# EAGLE design ultrasonic_distance_meter (EAGLE 6.1)
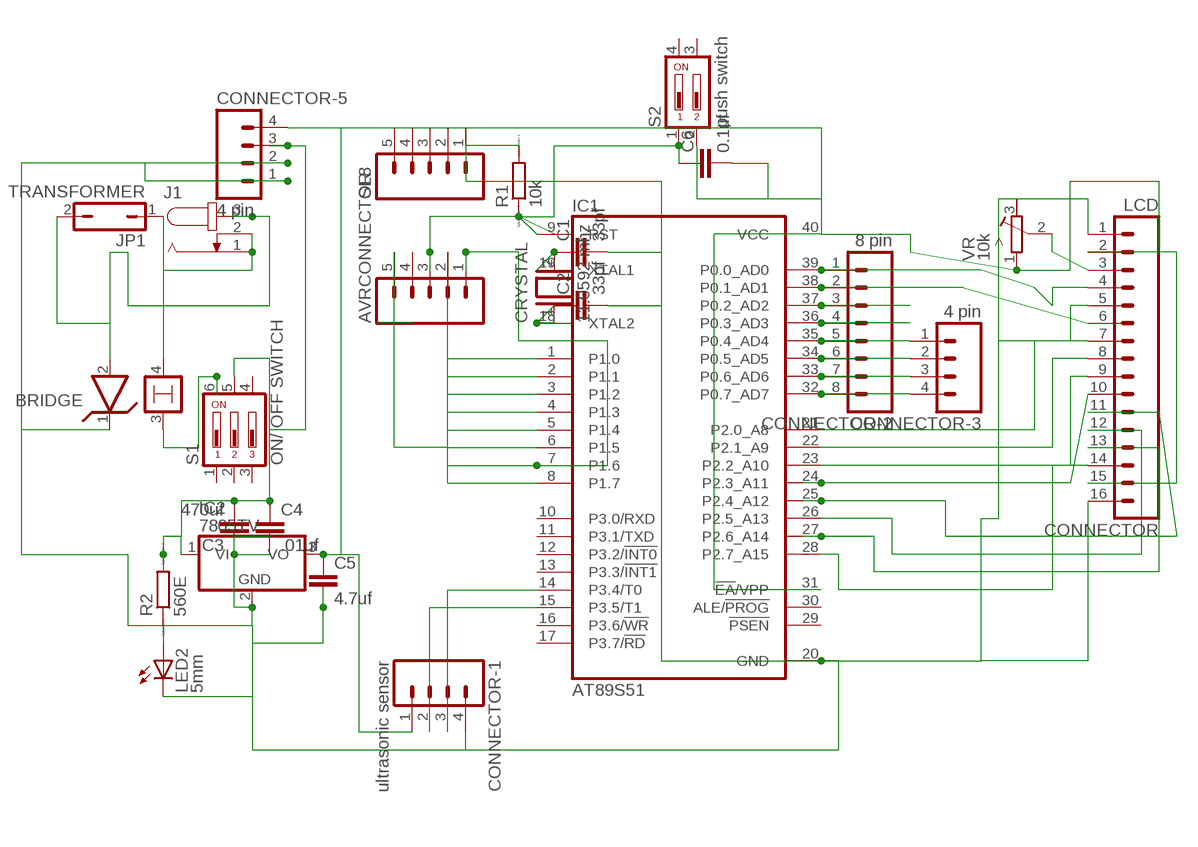
[diagram p0: schematic, sheet 1]

## Parts
AVRCONNECTOR  M05  [05P]
BRIDGE  LM399H  [TO39/4]
C1  33pf  C-EU025-024X044  [C025-024X044]
C2  33pf  C-EU025-024X044  [C025-024X044]
C3  470uf  C5/7.2  [C5B7.2]
C4  .01uf  C2,5-3  [C2.5-3]
C5  4.7uf  C2,5-3  [C2.5-3]
C6  0.1uf  C2.5/6  [C2.5-6]
CONNECTOR  LCD  M16  [16P]
CONNECTOR-1  ultrasonic sensor  M04  [04P]
CONNECTOR-2  8 pin  M08  [08P]
CONNECTOR-3  4 pin  M04  [04P]
CONNECTOR-5  4 pin  M04  [04P]
CRYSTAL  11.0592 mhz  XTAL/S  [QS]
IC1  AT89S51  AT89C51-12PC  [DIL40]
IC2  7805TV  [TO220V]
J1  JACK-PLUG0  [SPC4077]
JP1  TRANSFORMER  JP1Q  [JP1]
LED2  5mm  LED5MM  [LED5MM]
R1  10k  R0204/7  [0204/7]
R2  560E  R0204/7  [0204/7]
S1  ON/ OFF SWITCH  DA03  [DA-03]
S2  push switch  DP02  [DP-02]
SL8  M05  [05P]
VR  10k  R-TRIMM64P  [RTRIM64P]

## Nets
N$1: C2.1 CRYSTAL.1 IC1.18(XTAL2)
N$2: C1.1 CRYSTAL.2 IC1.19(XTAL1)
N$3: CONNECTOR-1.2 IC1.15(P3.5/T1)
N$4: C3.2 C4.1 CONNECTOR-5.3 IC2.1(VI) R2.2 S1.5
N$5: BRIDGE.2 J1.3 JP1.2
N$6: CONNECTOR-1.3 IC1.14(P3.4/T0)
N$14: AVRCONNECTOR.3 C6.1 IC1.9(RST) R1.1 S2.1
N$15: AVRCONNECTOR.1 IC1.7(P1.6)
N$16: BRIDGE.4 J1.1 J1.2 JP1.1
N$17: IC1.5(P1.4)
N$18: IC1.4(P1.3)
N$19: IC1.3(P1.2)
N$20: IC1.2(P1.1)
N$21: IC1.1(P1.0)
N$24: CONNECTOR-2.3 IC1.37(P0.2_AD2)
N$25: CONNECTOR-2.4 IC1.36(P0.3_AD3)
N$26: CONNECTOR-2.5 CONNECTOR-3.1 IC1.35(P0.4_AD4)
N$27: CONNECTOR-2.6 CONNECTOR-3.2 IC1.34(P0.5_AD5)
N$28: CONNECTOR-2.7 CONNECTOR-3.3 IC1.33(P0.6_AD6)
N$29: CONNECTOR-2.8 CONNECTOR-3.4 IC1.32(P0.7_AD7)
N$30: CONNECTOR.7 IC1.21(P2.0_A8)
N$31: CONNECTOR.8 IC1.22(P2.1_A9)
N$32: CONNECTOR.9 IC1.23(P2.2_A10)
N$35: CONNECTOR.12 IC1.26(P2.5_A13)
N$38: CONNECTOR.3 VR.2(S)
N$39: C5.1 C6.2 CONNECTOR-1.1 CONNECTOR-5.4 CONNECTOR.2 CONNECTOR.15 IC1.31(!EA!/VPP) IC1.40(VCC) IC2.3(VO) S2.2 VR.1(E)
N$41: BRIDGE.1 C1.2 C2.2 C3.1 C4.2 C5.2 CONNECTOR-1.4 CONNECTOR-5.1 CONNECTOR-5.2 CONNECTOR.1 CONNECTOR.5 CONNECTOR.16 IC1.20(GND) IC2.2(GND) LED2.K(C) R1.2 SL8.1 VR.3(A)
N$42: AVRCONNECTOR.5 IC1.6(P1.5)
N$43: LED2.A R2.1
N$45: AVRCONNECTOR.2 IC1.8(P1.7)
N$47: BRIDGE.3 S1.6
N$48: CONNECTOR-2.2 CONNECTOR.6 IC1.38(P0.1_AD1)
N$51: CONNECTOR.10 IC1.24(P2.3_A11)
N$52: CONNECTOR.11 IC1.25(P2.4_A12)
N$54: CONNECTOR.13 IC1.27(P2.6_A14)
N$55: CONNECTOR.14 IC1.28(P2.7_A15)
N$58: CONNECTOR-2.1 CONNECTOR.4 IC1.39(P0.0_AD0)
Unconnected: AVRCONNECTOR.4 IC1.10(P3.0/RXD) IC1.11(P3.1/TXD) IC1.12(P3.2/!INT0) IC1.13(P3.3/!INT1) IC1.16(P3.6/!WR) IC1.17(P3.7/!RD) IC1.29(!PSEN) IC1.30(ALE/!PROG) S1.1 S1.2 S1.3 S1.4 S2.3 S2.4 SL8.2 SL8.3 SL8.4 SL8.5

## Library data of the parts
AVRCONNECTOR SL8 = con-amp-quick:M05: AMP QUICK CONNECTOR; OC_FARNELL: unknown; OC_NEWARK: unknown
BRIDGE = linear:LM399H: Precision Z DIODE
C1 C2 = rcl:C-EU: CAPACITOR, European symbol
C3-C6 = capacitor-wima:C: CAPACITOR naming: grid - package width
CONNECTOR = con-amp-quick:M16: AMP QUICK CONNECTOR; OC_FARNELL: unknown; OC_NEWARK: unknown
CONNECTOR-1 CONNECTOR-3 CONNECTOR-5 = con-amp-quick:M04: AMP QUICK CONNECTOR; OC_FARNELL: unknown; OC_NEWARK: unknown
CONNECTOR-2 = con-amp-quick:M08: AMP QUICK CONNECTOR; OC_FARNELL: unknown; OC_NEWARK: unknown
CRYSTAL = special:XTAL/S: CRYSTAL
IC1 = atmel:AT89C51-*: 8-bit Microcontroller with 4K Bytes Flash Not Recommended for New Designs. Use AT89S51. Source: http://www.atmel.com/dyn/resources/prod_documents/doc0265.; OC_FARNELL: unknown; OC_NEWARK: unknown
IC2 = linear:78*: Positive VOLTAGE REGULATOR Source: http://cache.national.com/ds/LM/LM78L05.pdf http://www.fairchildsemi.com/ds/LM/LM7805.pdf
J1 = con-jack:JACK-PLUG: DC POWER JACK Power Jack, DC, Right Angle, Through Hole, Rated 5A at 16VDC, PC Terminals Distributor: Farnell (www.Farnell.de) Drawing: 84N1161.pdf / 84N1162.pdf Manufacturer: SPC Technology (www.spctechnology.com) Type: SPC4077 / SPC 4078; OC_FARNELL: unknown; OC_NEWARK: unknown
JP1 = jumper:JP1Q: JUMPER
LED2 = led:LED: LED OSRAM: - CHIPLED LG R971, LG N971, LY N971, LG Q971, LY Q971, LO R971, LY R971 LH N974, LH R974 LS Q976, LO Q976, LY Q976 LO Q996 - Hyper CHIPLED LW Q18S LB Q993, LB Q99A, LB R99A - SideLED LS A670, LO A670, LY A670, LG A670, LP A670 LB A673, LV A673, LT A673, LW A673 LH A674 LY A675 LS A676, LA A676, LO A676, LY A676, LW A676 LS A679, LY A679, LG A679 - Hyper Micro SIDELED® LS Y876, LA Y876, LO Y876, LY Y876 LT Y87S - SmartLED LW L88C, LW L88S LB L89C, LB L89S, LG L890 LS L89K, LO L89K, LY L89K LS L896, LA L896, LO L896, LY L896 - TOPLED LS T670, LO T670, LY T670, LG T670, LP T670 LSG T670, LSP T670, LSY T670, LOP T670, LYG T670 LG T671, LOG T671, LSG T671 LB T673, LV T673, LT T673, LW T673 LH T674 LS T676, LA T676, LO T676, LY T676, LB T676, LH T676, LSB T676, LW T676 LB T67C, LV T67C, LT T67C, LS T67K, LO T67K, LY T67K, LW E67C LS E67B, LA E67B, LO E67B, LY E67B, LB E67C, LV E67C, LT E67C LW T67C LS T679, LY T679, LG T679 LS T770, LO T770, LY T770, LG T770, LP T770 LB T773, LV T773, LT T773, LW T773 LH T774 LS E675, LA E675, LY E675, LS T675 LS T776, LA T776, LO T776, LY T776, LB T776 LHGB T686 LT T68C, LB T68C - Hyper Mini TOPLED® LB M676 - Mini TOPLED Santana® LG M470 LS M47K, LO M47K, LY M47K Source: http://www.osram.convergy.de LUXEON: - LUMILED® LXK2-PW12-R00, LXK2-PW12-S00, LXK2-PW14-U00, LXK2-PW14-V00 LXK2-PM12-R00, LXK2-PM12-S00, LXK2-PM14-U00 LXK2-PE12-Q00, LXK2-PE12-R00, LXK2-PE12-S00, LXK2-PE14-T00, LXK2-PE14-U00 LXK2-PB12-K00, LXK2-PB12-L00, LXK2-PB12-M00, LXK2-PB14-N00, LXK2-PB14-P00, LXK2-PB14-Q00 LXK2-PR12-L00, LXK2-PR12-M00, LXK2-PR14-Q00, LXK2-PR14-R00 LXK2-PD12-Q00, LXK2-PD12-R00, LXK2-PD12-S00 LXK2-PH12-R00, LXK2-PH12-S00 LXK2-PL12-P00, LXK2-PL12-Q00, LXK2-PL12-R00 Source: www.luxeon.com KINGBRIGHT: KA-3528ASYC Source: www.kingbright.com
R1 R2 = eagle-ltspice:R: RESISTOR, European symbol; SPICEMODEL: NONE; SPICEPREFIX: R
S1 = switch-dil:DA03: DIL/CODE SWITCH; MPN: MCDA03; OC_FARNELL: 1521999; OC_NEWARK: 74M2972
S2 = switch-dil:DP02: DIL/CODE SWITCH; MPN: MCDP02; OC_FARNELL: 1255233; OC_NEWARK: 26M1095
VR = resistor:R-TRIMM: Trimm resistor

## Board
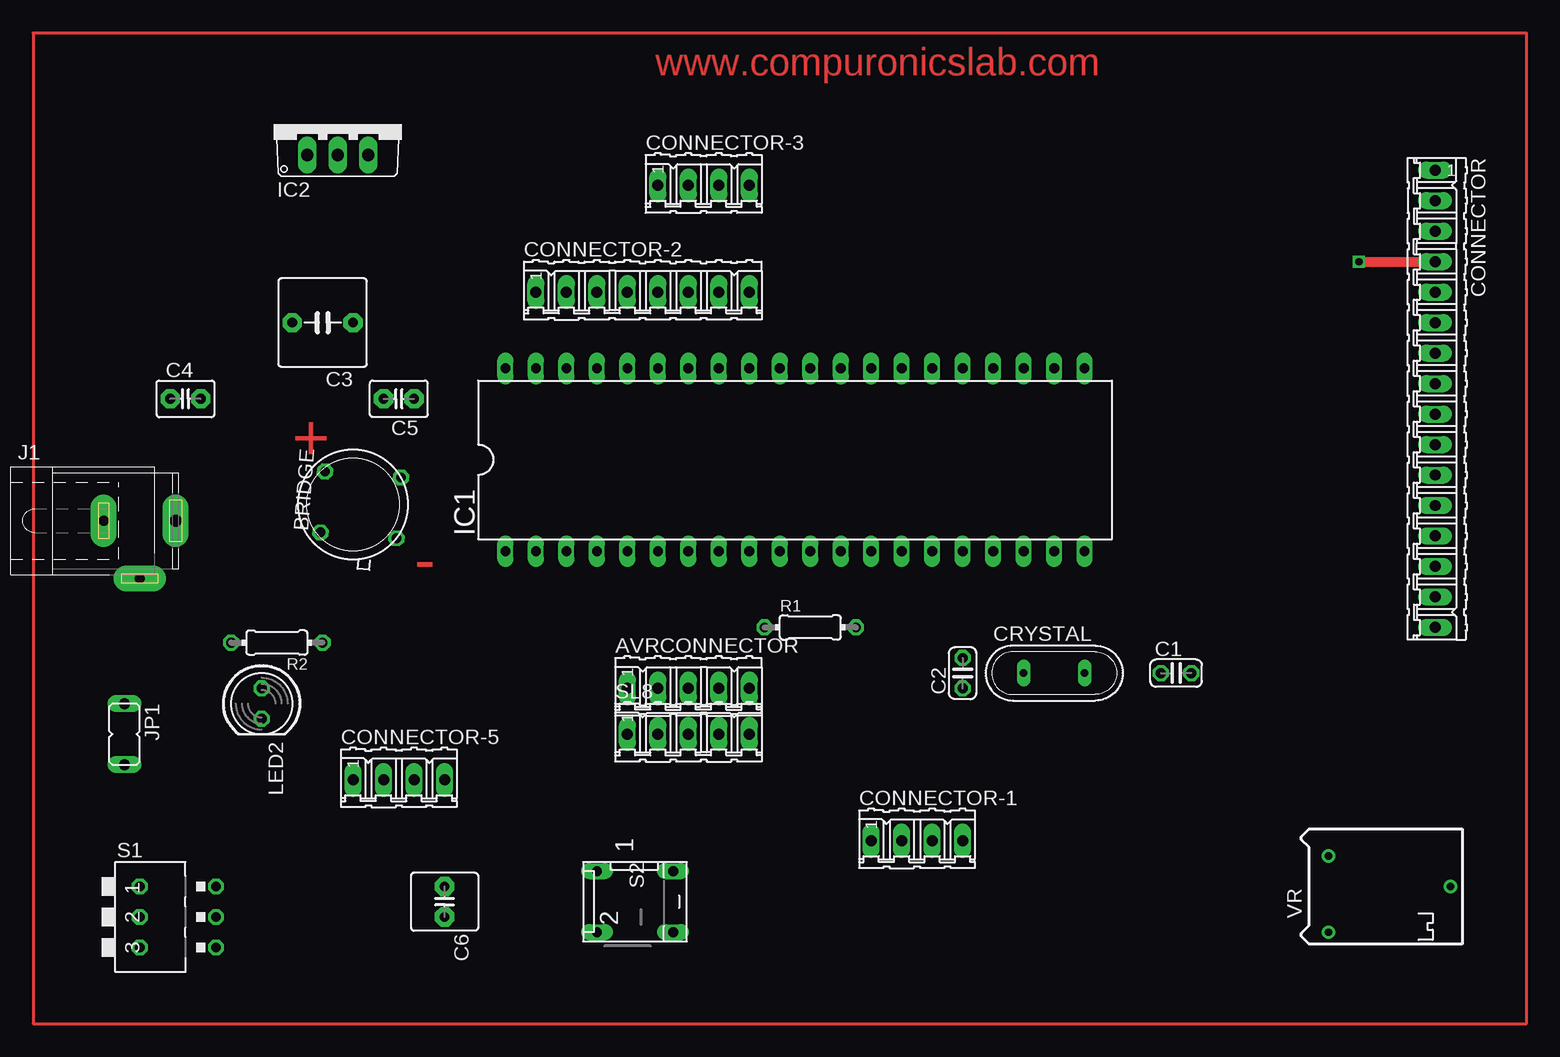
[diagram p1: board, top side]
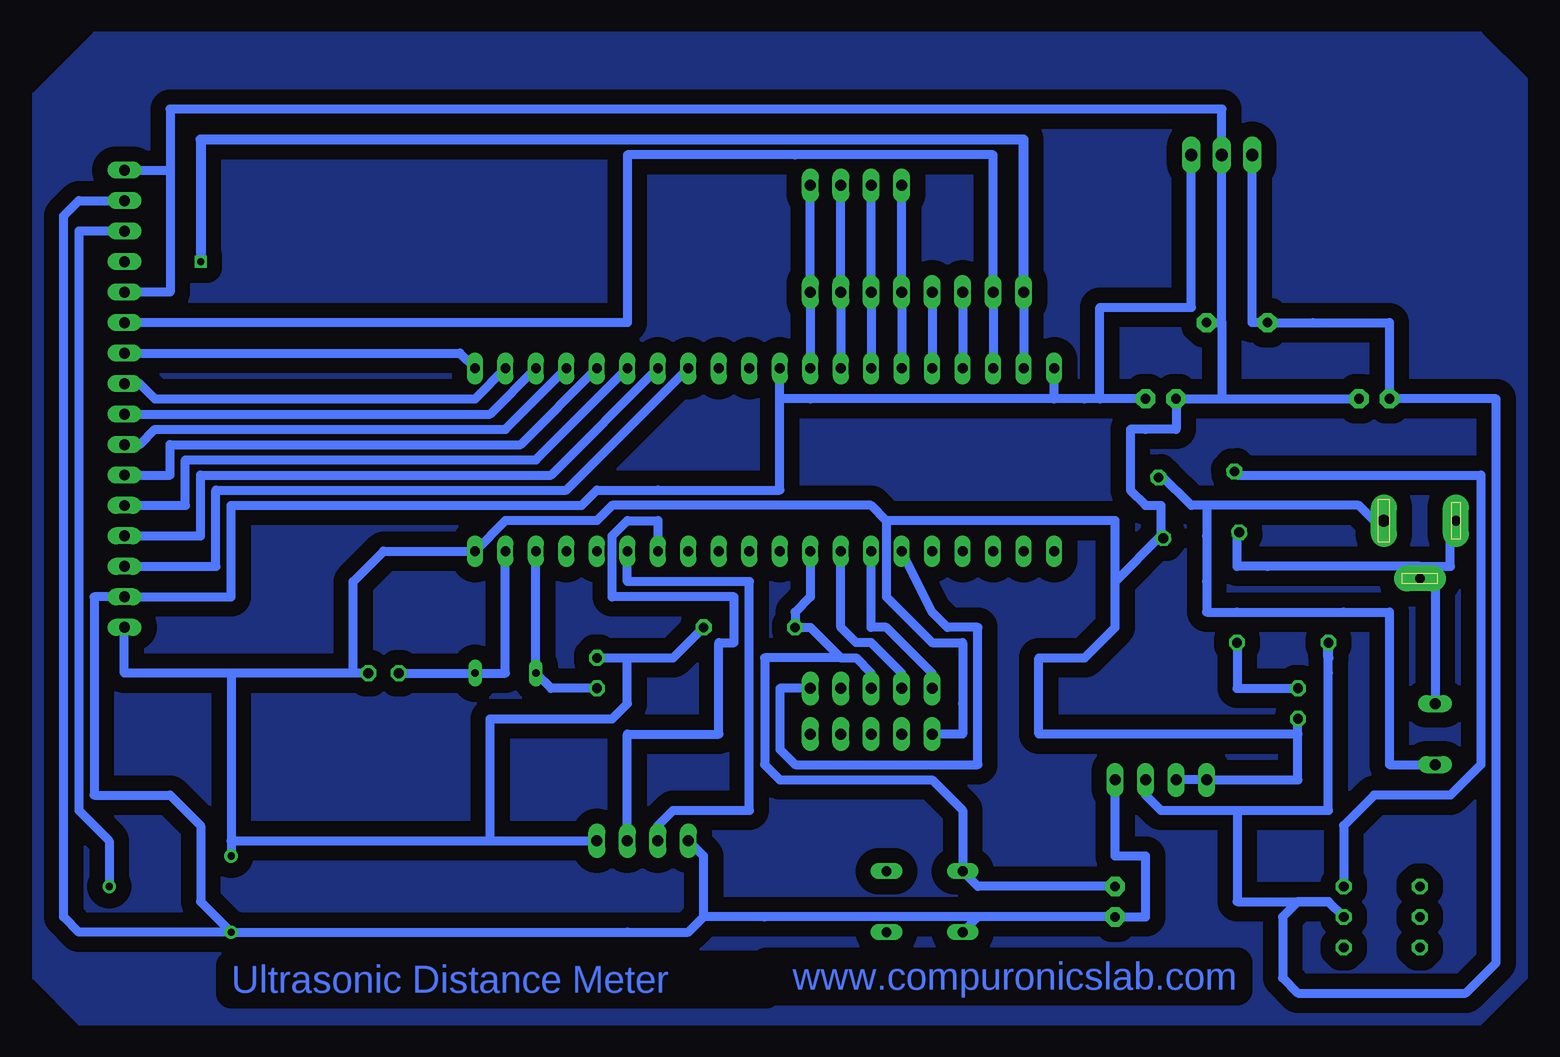
[diagram p2: board, bottom side, seen from below]

No outline drawn. Coordinates in mm, seen from the top.
Copper layers (1*16): Top 0.035mm / dielectric 1.5mm / Bottom 0.035mm
Design rules: minimum track width 30mil, minimum drill 24mil, track to track 20mil, track to pad 8mil, pad to pad 8mil, via to via 8mil, smd to smd 8mil, copper to edge 20mil, drill to drill 8mil, minimum pad ring 10mil, minimum via ring 8mil, stop-mask expansion 8mil, vias tented up to drill 0mil, thermal gap 20mil

### Footprints (pad centres in the part's own frame; a part is rotated, then mirrored left to right if it is on the bottom)
05P = drill 0.914 long: 1 -5.08,0; 2 -2.54,0; 3 0,0; 4 2.54,0; 5 5.08,0
TO39/4 = drill 0.813 octagon: 1 -2.54,-2.54; 2 2.54,-2.54; 3 2.54,3.81; 4 -2.54,3.81
C025-024X044 = drill 0.813 octagon: 1 -1.27,0; 2 1.27,0
C5B7.2 = drill 0.813 pad 1.6 octagon: 1 -2.54,0; 2 2.54,0
C2.5-3 = drill 0.813 pad 1.6 octagon: 1 -1.27,0; 2 1.27,0
C2.5-6 = drill 0.813 pad 1.6 octagon: 1 -1.27,0; 2 1.27,0
16P = drill 0.914 long: 1 -19.05,0; 2 -16.51,0; 3 -13.97,0; 4 -11.43,0; 5 -8.89,0; 6 -6.35,0; 7 -3.81,0; 8 -1.27,0; 9 1.27,0; 10 3.81,0; 11 6.35,0; 12 8.89,0; 13 11.43,0; 14 13.97,0; 15 16.51,0; 16 19.05,0
04P = drill 0.914 long: 1 -3.81,0; 2 -1.27,0; 3 1.27,0; 4 3.81,0
08P = drill 0.914 long: 1 -8.89,0; 2 -6.35,0; 3 -3.81,0; 4 -1.27,0; 5 1.27,0; 6 3.81,0; 7 6.35,0; 8 8.89,0
QS = drill 0.61 long: 1 -2.54,0; 2 2.54,0
DIL40 = drill 0.813 long: 1 -24.13,-7.62; 2 -21.59,-7.62; 3 -19.05,-7.62; 4 -16.51,-7.62; 5 -13.97,-7.62; 6 -11.43,-7.62; 7 -8.89,-7.62; 8 -6.35,-7.62; 9 -3.81,-7.62; 10 -1.27,-7.62; 11 1.27,-7.62; 12 3.81,-7.62; 13 6.35,-7.62; 14 8.89,-7.62; 15 11.43,-7.62; 16 13.97,-7.62; 17 16.51,-7.62; 18 19.05,-7.62; 19 21.59,-7.62; 20 24.13,-7.62; 21 24.13,7.62; 22 21.59,7.62; 23 19.05,7.62; 24 16.51,7.62; 25 13.97,7.62; 26 11.43,7.62; 27 8.89,7.62; 28 6.35,7.62; 29 3.81,7.62; 30 1.27,7.62; 31 -1.27,7.62; 32 -3.81,7.62; 33 -6.35,7.62; 34 -8.89,7.62; 35 -11.43,7.62; 36 -13.97,7.62; 37 -16.51,7.62; 38 -19.05,7.62; 39 -21.59,7.62; 40 -24.13,7.62
TO220V = drill 1.016 long: 1 -2.54,-2.54; 2 0,-2.54; 3 2.54,-2.54
SPC4077 = drill 0.8 pad 2.184 long: 1 -3,0; 2 0,-4.8 | drill 1 pad 2.184 long: 3 3,0
JP1 = drill 0.914 long: 1 0,-2.54; 2 0,2.54
LED5MM = drill 0.813 octagon: A -1.27,0; K 1.27,0
0204/7 = drill 0.813 octagon: 1 -3.81,0; 2 3.81,0
DA-03 = drill 0.813 octagon: 1 -2.54,-5.08; 2 0,-5.08; 3 2.54,-5.08; 4 2.54,1.27; 5 0,1.27; 6 -2.54,1.27
DP-02 = drill 0.813 long: 1 -2.54,-2.54; 2 2.54,-2.54; 3 2.54,3.81; 4 -2.54,3.81
RTRIM64P = drill 0.61: 1 -2.54,-3.81; 2 7.62,0; 3 -2.54,2.54

### Placement (x,y rotation side)
AVRCONNECTOR  44.45,26.67 0 top
BRIDGE  17.78,41.91 85.6 top
C1  85.09,27.94 0 top
C2  67.31,27.94 90 top
C3  13.97,57.15 180 top
C4  2.54,50.8 0 top
C5  20.32,50.8 180 top
C6  24.13,8.89 270 top
CONNECTOR  106.68,50.8 270 top
CONNECTOR-1  63.5,13.97 0 top
CONNECTOR-2  40.64,59.69 0 top
CONNECTOR-3  45.72,68.58 0 top
CONNECTOR-5  20.32,19.05 0 top
CRYSTAL  74.93,27.94 0 top
IC1  53.34,45.72 0 top
IC2  15.24,73.66 0 top
J1  -1.27,40.64 0 top
JP1  -2.54,22.86 180 top
LED2  8.89,25.4 270 top
R1  54.61,31.75 0 top
R2  10.16,30.48 180 top
S1  3.81,7.62 270 top
S2  39.37,8.89 270 top
SL8  44.45,22.86 0 top
VR  100.33,10.16 0 top

### Tracks (layer width: path | path; a pad name or v marks a point on that pad's centre or on a via)
N$1
  Bottom 0.762: C2.1 71.12,26.67 CRYSTAL.1 IC1.18
N$2
  Bottom 0.762: C1.1 CRYSTAL.2 74.93,27.94 IC1.19
N$3
  Bottom 0.762: IC1.15 64.77,35.56 62.23,35.56 54.61,35.56 54.61,16.51 60.96,16.51 62.23,15.24 CONNECTOR-1.2
N$4
  Bottom 0.406: 6.35,29.21 R2.2 6.35,29.21 | 6.35,29.21 6.35,27.94 6.35,29.21
  Bottom 0.762: IC2.1 12.7,57.15 C3.2 7.62,57.15 1.27,57.15 C4.1 -7.62,50.8 -7.62,45.72 -7.62,8.89 -7.62,3.81 -5.08,1.27 8.89,1.27 10.16,2.54 10.16,7.62 8.89,8.89 6.35,8.89 | 13.97,16.51 13.97,8.89 6.35,8.89 | 6.35,8.89 S1.5 | 13.97,16.51 20.32,16.51 21.59,17.78 CONNECTOR-5.3 | 6.35,29.21 6.35,27.94 6.35,16.51 7.62,16.51 13.97,16.51
  Bottom 0.813: 6.35,29.21 R2.2
N$5
  Bottom 0.762: 16.51,41.91 3.81,41.91 2.54,40.64 J1.3 | 16.51,41.91 17.78,41.91 20.32,44.45 BRIDGE.2 | JP1.2 1.27,20.32 1.27,29.21 1.27,33.02 5.08,33.02 13.97,33.02 16.51,33.02 16.51,35.56 16.51,39.37 16.51,41.91
N$6
  Bottom 0.762: IC1.14 62.23,40.64 64.77,40.64 66.04,39.37 66.04,34.29 55.88,34.29 55.88,30.48 57.15,30.48 57.15,22.86 64.77,22.86 CONNECTOR-1.3
N$7
  Top 0.254: -10.16,-1.27 114.3,-1.27 114.3,81.28 -10.16,81.28 -10.16,-1.27
N$8
  pour Bottom (isolate 1.27, rank 3): -6.35,-1.27 -10.16,2.54 -10.16,77.47 -6.35,81.28 109.22,81.28 114.3,76.2 114.3,2.54 110.49,-1.27
N$14
  Bottom 0.762: C6.1 35.56,10.16 S2.1 36.83,16.51 39.37,19.05 44.45,19.05 52.07,19.05 53.34,20.32 53.34,29.21 46.99,29.21 | IC1.9 49.53,34.29 50.8,33.02 R1.1 49.53,31.75 46.99,29.21 | AVRCONNECTOR.3 44.45,27.94 45.72,29.21 46.99,29.21
N$15
  Bottom 0.762: IC1.7 44.45,31.75 43.18,31.75 39.37,27.94 AVRCONNECTOR.1
N$16
  Bottom 0.762: 0,36.83 -1.27,36.83 J1.2 | 0,36.83 11.43,36.83 13.97,36.83 13.97,39.37 BRIDGE.4 | JP1.1 -2.54,35.56 -1.27,35.56 J1.2 | 0,36.83 -3.81,36.83 -3.81,40.64 J1.1 | 0,36.83 J1.2
N$24
  Bottom 0.762: CONNECTOR-2.3 IC1.37
N$25
  Bottom 0.762: CONNECTOR-2.4 IC1.36
N$26
  Bottom 0.762: IC1.35 CONNECTOR-2.5 CONNECTOR-3.1
N$27
  Bottom 0.762: IC1.34 CONNECTOR-2.6 CONNECTOR-3.2
N$28
  Bottom 0.762: IC1.33 CONNECTOR-2.7 CONNECTOR-3.3
N$29
  Bottom 0.762: IC1.32 CONNECTOR-2.8 CONNECTOR-3.4
N$30
  Bottom 0.762: IC1.21 78.74,54.61 CONNECTOR.7
N$31
  Bottom 0.762: IC1.22 77.47,50.8 104.14,50.8 105.41,52.07 CONNECTOR.8
N$32
  Bottom 0.762: IC1.23 76.2,49.53 CONNECTOR.9
N$35
  Bottom 0.762: IC1.26 72.39,45.72 101.6,45.72 101.6,41.91 105.41,41.91 CONNECTOR.12
N$38
  Bottom 0.762: VR.2 107.95,13.97 110.49,16.51 110.49,64.77 CONNECTOR.3
N$39
  Bottom 0.762: 26.67,50.8 29.21,50.8 IC1.40 | C5.1 25.4,50.8 | 25.4,50.8 26.67,50.8 | 26.67,50.8 49.53,50.8 52.07,50.8 IC1.31 52.07,43.18 62.23,43.18 67.31,43.18 68.58,41.91 97.79,41.91 97.79,34.29 105.41,34.29 CONNECTOR.15 109.22,34.29 109.22,17.78 102.87,17.78 100.33,15.24 100.33,8.89 | IC2.3 17.78,58.42 25.4,58.42 25.4,50.8 | 35.56,7.62 S2.2 | 35.56,7.62 C6.2 21.59,7.62 21.59,10.16 21.59,12.7 24.13,12.7 CONNECTOR-5.4 | 58.42,7.62 53.34,7.62 35.56,7.62 | 58.42,7.62 58.42,12.7 | 58.42,12.7 CONNECTOR-1.1 | 100.33,8.89 VR.1 | CONNECTOR.2 110.49,67.31 111.76,66.04 111.76,8.89 111.76,7.62 110.49,6.35 VR.1 | 100.33,8.89 VR.1 | 58.42,7.62 59.69,6.35 64.77,6.35 VR.1 | 58.42,7.62 58.42,12.7
N$41
  Bottom 0.762: R1.2 60.96,29.21 64.77,29.21 | C2.2 64.77,29.21 | 97.79,27.94 97.79,13.97 | 97.79,13.97 VR.3 | C1.2 87.63,27.94 | 87.63,27.94 97.79,27.94 | 87.63,27.94 87.63,35.56 85.09,38.1 IC1.20 74.93,40.64 67.31,40.64 66.04,41.91 44.45,41.91 43.18,40.64 | 97.79,13.97 76.2,13.97 | 76.2,13.97 CONNECTOR-1.4 | CONNECTOR.16 106.68,27.94 102.87,27.94 97.79,27.94 | 64.77,29.21 64.77,25.4 66.04,24.13 69.85,24.13 76.2,24.13 76.2,17.78 76.2,13.97 | 8.89,22.86 8.89,19.05 15.24,19.05 CONNECTOR-5.1 CONNECTOR-5.2 | 8.89,22.86 LED2.K | 24.13,35.56 24.13,31.75 26.67,29.21 30.48,29.21 30.48,22.86 8.89,22.86 | 24.13,35.56 20.32,39.37 | 20.32,39.37 BRIDGE.1 20.32,39.37 | SL8.1 36.83,22.86 36.83,25.4 36.83,30.48 39.37,30.48 43.18,34.29 43.18,36.83 43.18,40.64 | 43.18,40.64 29.21,40.64 24.13,40.64 24.13,35.56 | 15.24,50.8 C5.2 19.05,48.26 21.59,48.26 22.86,48.26 22.86,44.45 22.86,43.18 21.59,41.91 20.32,41.91 20.32,39.37 | 15.24,50.8 C4.2 | CONNECTOR.5 105.41,59.69 102.87,59.69 102.87,69.85 | CONNECTOR.1 102.87,69.85 | 15.24,57.15 IC2.2 15.24,72.39 15.24,74.93 102.87,74.93 102.87,69.85 | C3.1 15.24,57.15 | 15.24,57.15 15.24,50.8
N$42
  Bottom 0.762: IC1.6 39.37,33.02 38.1,31.75 35.56,31.75 35.56,20.32 50.8,20.32 52.07,21.59 52.07,26.67 AVRCONNECTOR.5
N$43
  Bottom 0.762: R2.1 13.97,26.67 LED2.A
N$45
  Bottom 0.762: IC1.8 46.99,31.75 45.72,30.48 44.45,30.48 41.91,27.94 AVRCONNECTOR.2
N$47
  Bottom 0.762: S1.6 5.08,15.24 2.54,17.78 -2.54,17.78 -3.81,17.78 -6.35,20.32 -6.35,44.45 13.97,44.45 BRIDGE.3
N$48
  Bottom 0.762: IC1.38 CONNECTOR-2.2 34.29,64.77 34.29,71.12 50.8,71.12 64.77,71.12 64.77,59.69 64.77,57.15 CONNECTOR.6
N$51
  Bottom 0.762: IC1.24 74.93,48.26 104.14,48.26 105.41,46.99 CONNECTOR.10
N$52
  Bottom 0.762: IC1.25 73.66,46.99 102.87,46.99 102.87,44.45 105.41,44.45 CONNECTOR.11
N$54
  Bottom 0.762: IC1.27 71.12,44.45 100.33,44.45 100.33,39.37 105.41,39.37 CONNECTOR.13
N$55
  Bottom 0.762: IC1.28 69.85,43.18 99.06,43.18 99.06,36.83 105.41,36.83 CONNECTOR.14
N$58  (via drill 0.6)
  Top 0.813: v100.33,62.23 CONNECTOR.4
  Bottom 0.762: CONNECTOR-2.1 IC1.39
  Bottom 0.813: CONNECTOR-2.1 31.75,72.39 100.33,72.39 v100.33,62.23

### Text on the board
Top: www.compuronicslab.com | + | -
Bottom: www.compuronicslab.com | Ultrasonic Distance Meter